# EAGLE design ADJD-S311_Breakout (EAGLE 6.4)
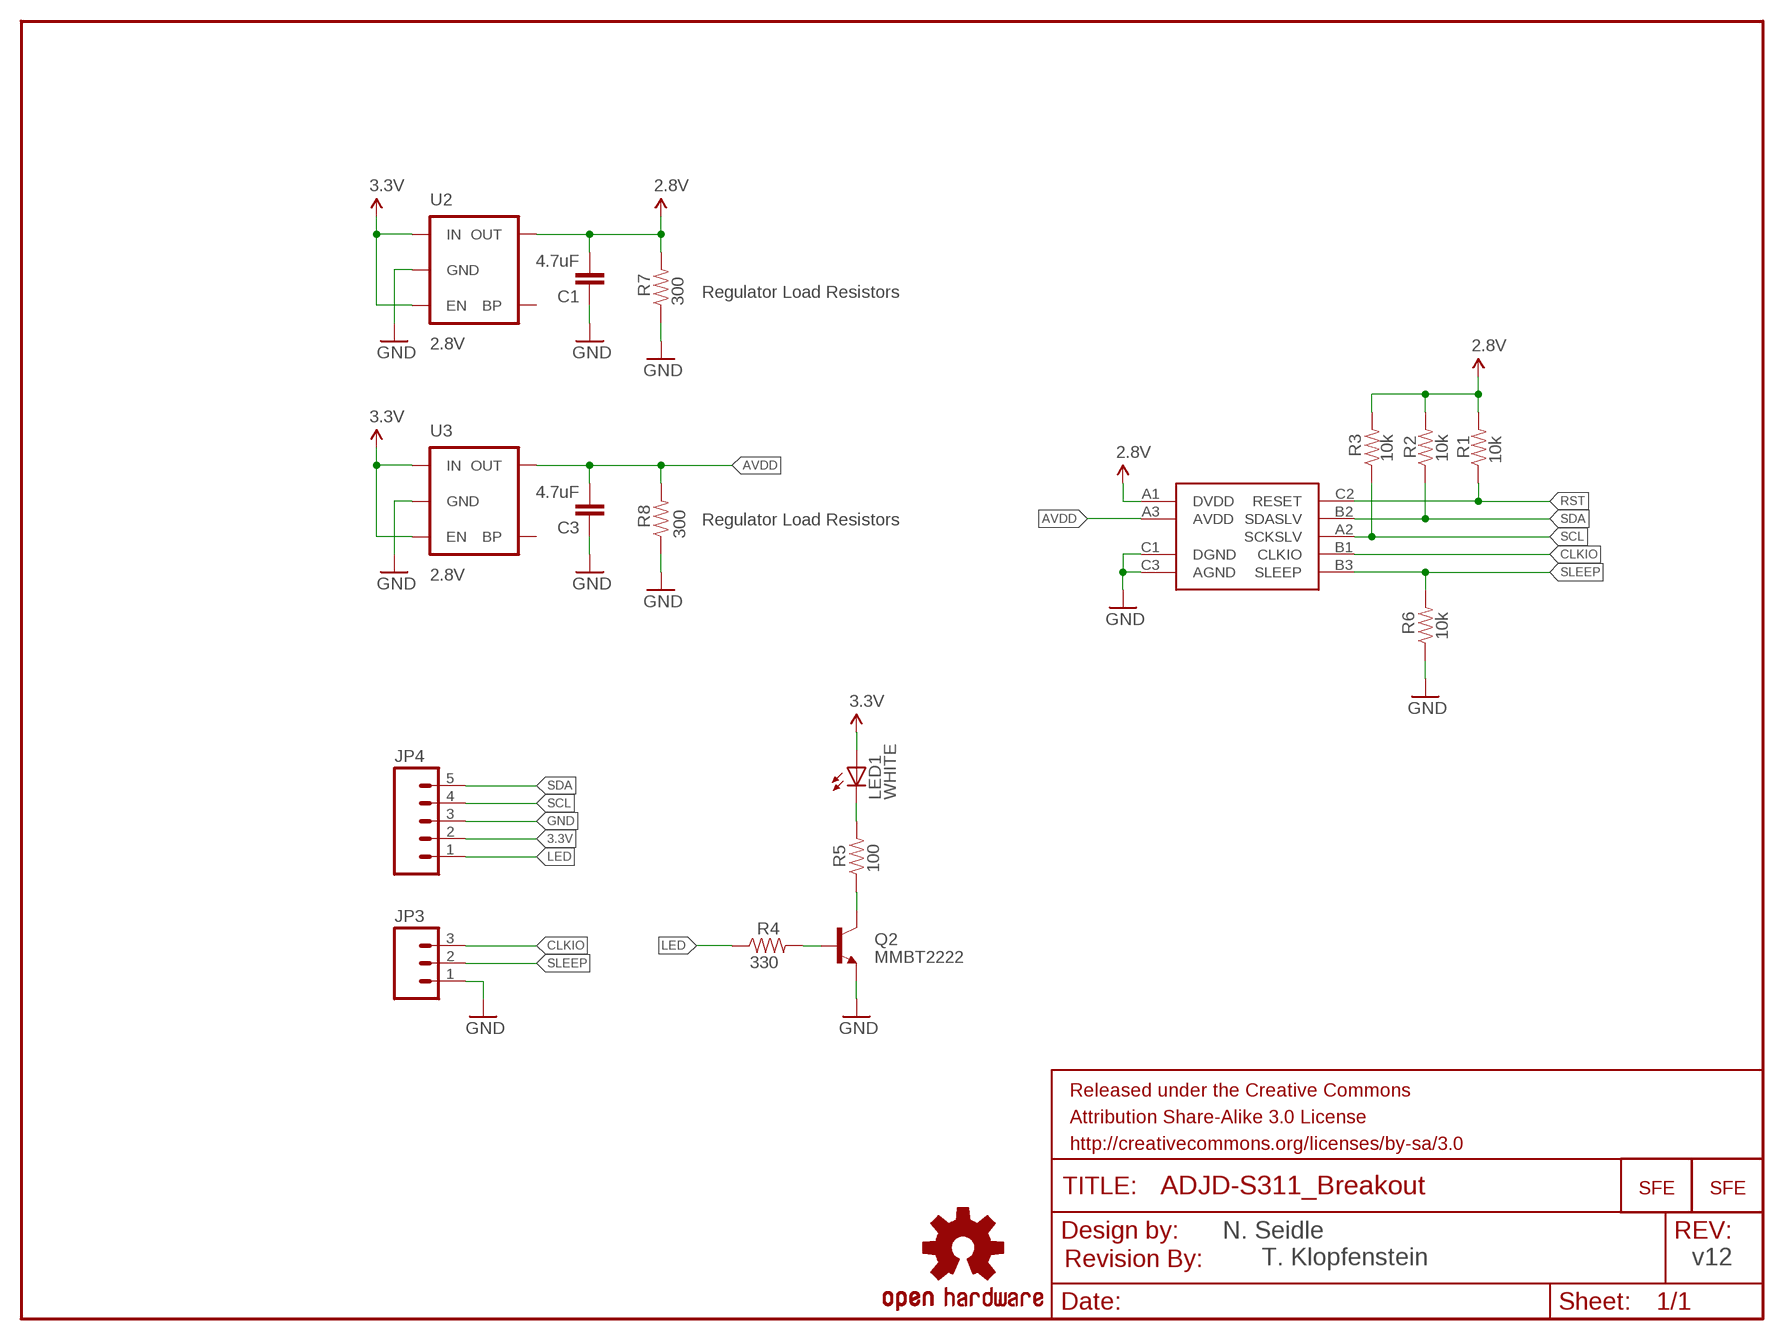
[diagram p0: schematic, sheet 1]

## Parts
C1  4.7uF  CAP0603-CAP  [0603-CAP]
C3  4.7uF  CAP0603-CAP  [0603-CAP]
FRAME1  FRAME-LETTER  [CREATIVE_COMMONS]
JP1  LOGO-SFESK  [SFE-LOGO-FLAME]
JP2  LOGO-SFESK  [SFE-LOGO-FLAME]
JP3  M03PTH  [1X03]
JP4  M05PTH  [1X05]
LED1  WHITE  LED0603  [LED-0603]
Q2  MMBT2222  TRANSISTOR_NPNSOT23-3  [SOT23-3]
R1  10k  RESISTOR0603-RES  [0603-RES]
R2  10k  RESISTOR0603-RES  [0603-RES]
R3  10k  RESISTOR0603-RES  [0603-RES]
R4  330  RESISTOR0603-RES  [0603-RES]
R5  100  RESISTOR0603-RES  [0603-RES]
R6  10k  RESISTOR0603-RES  [0603-RES]
R7  300  RESISTOR0603-RES  [0603-RES]
R8  300  RESISTOR0603-RES  [0603-RES]
U1  ADJD-S311-CR999  [CSP-9]
U2  2.8V  V_REG_LDOSMD  [SOT23-5]
U3  2.8V  V_REG_LDOSMD  [SOT23-5]
U$1  REVISION  [REVISION]
U$4  OSHW-LOGOS  [OSHW-LOGO-S]

## Nets
2.8V: C1.2 R1.2 R2.2 R3.2 R7.2 U1.A1(DVDD) U2.5(OUT)
3.3V: JP4.2 LED1.A U2.1(IN) U2.3(EN) U3.1(IN) U3.3(EN)
AVDD: C3.2 R8.2 U1.A3(AVDD) U3.5(OUT)
CLKIO: JP3.3 U1.B1(CLKIO)
GND: C1.1 C3.1 JP3.1 JP4.3 Q2.2(E) R6.1 R7.1 R8.1 U1.C1(DGND) U1.C3(AGND) U2.2(GND) U3.2(GND)
LED: JP4.1 R4.1
N$1: LED1.C R5.2
N$2: Q2.3(C) R5.1
N$3: Q2.1(B) R4.2
RST: R1.1 U1.C2(RESET)
SCL: JP4.4 R3.1 U1.A2(SCKSLV)
SDA: JP4.5 R2.1 U1.B2(SDASLV)
SLEEP: JP3.2 R6.2 U1.B3(SLEEP)
Unconnected: U2.4(BP) U3.4(BP)

## Notes on the sheet
- Regulator Load Resistors
- Regulator Load Resistors
- N. Seidle
- T. Klopfenstein | v12

## Library data of the parts
C1 C3 = SparkFun:CAP: Capacitor Standard 0603 ceramic capacitor, and 0.1" leaded capacitor.
FRAME1 = SparkFun-Aesthetics:FRAME-LETTER: Schematic Frame Standard 8.5x11 US Letter frame
JP1 JP2 = SparkFun:LOGO-SFE: Spark Fun Electronics PCB Logo This is the standard Spark Fun Electronics PCB logo.
JP3 = SparkFun:M03: Header 3 Standard 3-pin 0.1" header. Use with straight break away headers (SKU : PRT-00116), right angle break away headers (PRT-00553), swiss pins (PRT-00743), machine pins (PRT-00117), and female headers (PRT-00115). Molex polarized connector foot print use with SKU : PRT-08232 with associated crimp pins and housings.
JP4 = SparkFun:M05: Header 5 Standard 5-pin 0.1" header. Use with straight break away headers (SKU : PRT-00116), right angle break away headers (PRT-00553), swiss pins (PRT-00743), machine pins (PRT-00117), and female headers (PRT-00115). Molex polarized connector foot print use with SKU : PRT-08230 with associated crimp pins and housings.
LED1 = SparkFun:LED: LEDs Standard schematic elements and footprints for 5mm, 3mm, 1206, and 0603 sized LEDs. 5mm - Spark Fun Electronics SKU : COM-00529 (and others)
Q2 = SparkFun:TRANSISTOR_NPN: Transistor NPN BJT configuration in SOT23 package. MMBT2222 is the common NPN we use. Double check BCE configuration again layout.
R1-R8 = SparkFun:RESISTOR: Resistor Basic schematic elements and footprints for 0603, 1206, and PTH resistors.
U1 = SparkFun-Sensors:ADJD-S311-CR999
U2 U3 = SparkFun:V_REG_LDO: Voltage Regulator LDO Standard 150mA LDO voltage regulator in SOT-23 layout. Micrel part MIC5205. BP (by-pass) pin is used to lower output noise with 470pF cap.
U$1 = SparkFun-Aesthetics:REVISION
U$4 = SparkFun:OSHW-LOGO: Open Source Hardware Logo This logo indicates the piece of hardware it is found on incorporates a OSHW license and/or adheres to the definition of open source hardware found here: http://freedomdefined.org/OSHW

## Board
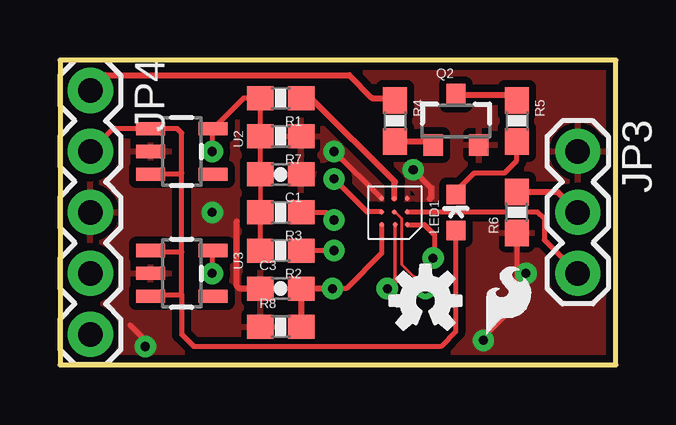
[diagram p1: board, top side]
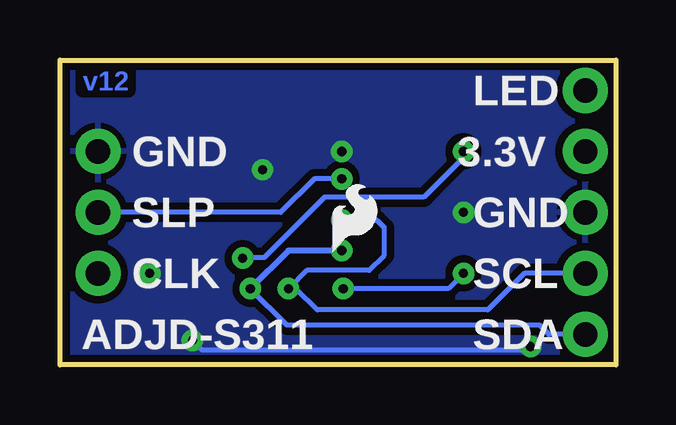
[diagram p2: board, bottom side, seen from below]

Size 23.18 x 12.7 mm. Coordinates in mm from the lower left corner, seen from the top.
Outline: 0,0 23.18,0 23.18,12.7 0,12.7 0,0
Copper layers (1*16): Top 0.035mm / dielectric 1.5mm / Bottom 0.035mm
Design rules "SparkFun *": minimum track width 5mil, minimum drill 15mil, track to track 4mil, track to pad 5mil, pad to pad 8mil, via to via 8mil, smd to smd 8mil, copper to edge 8mil, drill to drill 8mil, minimum pad ring 12mil, minimum via ring 10mil, stop-mask expansion 4mil, vias tented up to drill 20mil, thermal gap 10mil

### Footprints (pad centres in the part's own frame; a part is rotated, then mirrored left to right if it is on the bottom)
0603-CAP = smd 1.1 x 1: 1 -0.85,0; 2 0.85,0
1X03 = drill 1.016 pad 1.88: 1 0,0; 2 2.54,0; 3 5.08,0
1X05 = drill 1.016 pad 1.88: 1 0,0; 2 2.54,0; 3 5.08,0; 4 7.62,0; 5 10.16,0
LED-0603 = smd 0.8 x 0.8: A 0,-0.75; C 0,0.75
SOT23-3 = smd 0.8 x 0.9: 1 -0.95,-1; 2 0.95,-1; 3 0,1.1
0603-RES = smd 1.1 x 1: 1 -0.85,0; 2 0.85,0
CSP-9 = smd 0.21 x 0.21: A1 -0.509,0.509; A2 0,0.509; A3 0.56,0.509; B1 -0.509,-0.025; B2 0.025,-0.025; B3 0.56,-0.025; C1 -0.509,-0.585; C2 0.025,-0.585; C3 0.56,-0.585
SOT23-5 = smd 0.55 x 1.2: 1 -0.95,-1.3; 2 0,-1.3; 3 0.95,-1.3; 4 0.95,1.3; 5 -0.95,1.3

### Placement (x,y rotation side)
C1  9.21,7.94 180 top
C3  9.21,3.17 0 top
FRAME1  -7.09,-11.43 0 top  (outside the outline)
JP1  11.81,4.7 0 bottom
JP2  17.78,1.27 0 top
JP3  21.59,8.89 270 top
JP4  1.27,11.43 270 top
LED1  16.51,6.35 0 top
Q2  16.51,10.16 0 top
R1  9.21,11.11 180 top
R2  9.21,4.76 180 top
R3  9.21,6.35 180 top
R4  13.97,10.16 270 top
R5  19.05,10.16 270 top
R6  19.05,6.35 90 top
R7  9.21,9.53 180 top
R8  9.21,1.59 0 top
U1  13.97,6.35 180 top
U2  5.08,8.89 270 top
U3  5.08,3.81 270 top
U$1  4.32,-13.97 0 top  (outside the outline)
U$4  15.24,2.67 0 top

### Tracks (layer width: path | path; a pad name or v marks a point on that pad's centre or on a via)
2.8V  (via drill 0.38)
  Top 0.19: R3.2 C1.2
  Top 0.203: C1.2 R7.2 R1.2 7.65,11.11 U2.5 6.35,9.81 6.35,9.27 | R2.2 R3.2 | v15.56,4.45 15.62,4.51 15.62,5.42 15.2,5.84 U1.A1
  Top 0.254: v6.35,8.89 6.35,9.27
  Bottom 0.203: v6.35,8.89 6.35,8.64 8,6.99 12.14,6.99 14.66,4.46 15.54,4.46 v15.56,4.45
3.3V
  Top 0.203: U3.1 3.84,4.7 5.08,4.7 | U3.3 3.84,2.92 5.08,2.92 | U2.3 5.02,7.94 5.08,8 | 5.08,4.7 5.08,8 | JP4.2 2.22,9.84 U2.1 4.89,9.84 5.08,9.65 5.08,8 | 5.08,2.92 5.08,4.7 | 5.08,2.92 5.08,1.27 5.59,0.76 15.88,0.76 16.51,1.4 LED1.A
AVDD  (via drill 0.38)
  Top 0.19: 9.54,3.17 C3.2
  Top 0.203: v6.35,3.81 6.35,4.73 U3.5 | U1.A3 13.41,4.65 11.94,3.17 v11.37,3.17
  Top 0.254: v11.37,3.17 C3.2 R8.2
  Bottom 0.203: v11.37,3.17 6.99,3.17 v6.35,3.81
CLKIO
  Top 0.203: JP3.3 20.19,5.21 20.19,6.1 19.91,6.38 U1.B1
GND  (via drill 0.38)
  Top 0.203: U1.C3 v11.43,8.89 | R6.1 19.05,2.54 17.78,1.27 17.78,1.14 v17.65,1.02 | v3.56,0.76 3.56,1.02 2.92,1.65
  Top 0.254: 15.42,6.91 15.49,6.99 15.49,7.37 v14.73,8.13 | C3.1 7.49,3.17 7.37,3.3 7.37,5.97
  Bottom 0.203: v17.65,1.02 17.27,0.64 3.56,0.64 3.43,0.76 v3.56,0.76
  other vias: 19.43,3.81 6.35,6.35
  pour Bottom (isolate 0.305): 0,0 0,12.7 23.18,12.7 23.18,0
  pour Top (isolate 0.305): 0,0 0,12.7 23.18,12.7 23.18,0
LED
  Top 0.254: JP4.1 1.91,12.06 12.06,12.06 13.02,11.11 13.87,11.11 R4.1
N$1
  Top 0.203: LED1.C 16.51,7.24 17.27,8 18.54,8 19.05,8.51 R5.2
N$2
  Top 0.254: Q2.3 18.8,11.26 R5.1
N$3
  Top 0.254: R4.2 15.41,9.31 Q2.1
RST
  Top 0.203: 13.95,7.59 13.97,7.62
  Top 0.254: 13.97,7.62 10.48,11.11 R1.1 | U1.C2 13.95,7.59
SCL  (via drill 0.38)
  Top 0.127: U1.A2
  Top 0.152: U1.A2 13.97,3.49
  Top 0.203: R3.1 11.11,6.35 v11.43,6.03
  Top 0.254: 13.97,3.49 v13.65,3.17
  Bottom 0.203: JP4.4 3.81,3.81 5.33,2.29 12.45,2.29 13.34,3.17 | v13.65,3.17 12.89,3.94 10.29,3.94 9.65,4.57 9.65,5.71 9.97,6.03 v11.43,6.03
  Bottom 0.254: v13.65,3.17 13.34,3.17
SDA  (via drill 0.38)
  Top 0.127: v15.24,3.17 15.24,3.2 14.25,4.19 14.25,6.1 13.99,6.35 U1.B2
  Top 0.203: v11.43,4.76 R2.1
  Bottom 0.203: JP4.5 2.79,1.27 3.17,1.65 13.72,1.65 v15.24,3.17
  Bottom 0.254: v11.43,4.76 13.65,4.76 v15.24,3.17
SLEEP  (via drill 0.38)
  Top 0.203: U1.B3 12.8,6.38 v11.43,7.75
  Top 0.254: R6.2 20.74,7.2 JP3.2
  Bottom 0.203: JP3.2 13.97,6.35 12.57,7.75 v11.43,7.75

### Text on the board
Bottom: v12
bPlace: LED | 3.3V | GND | GND | SLP | SCL | CLK | SDA | ADJD-S311
tNames: N. Seidle | T. Klopfenstein